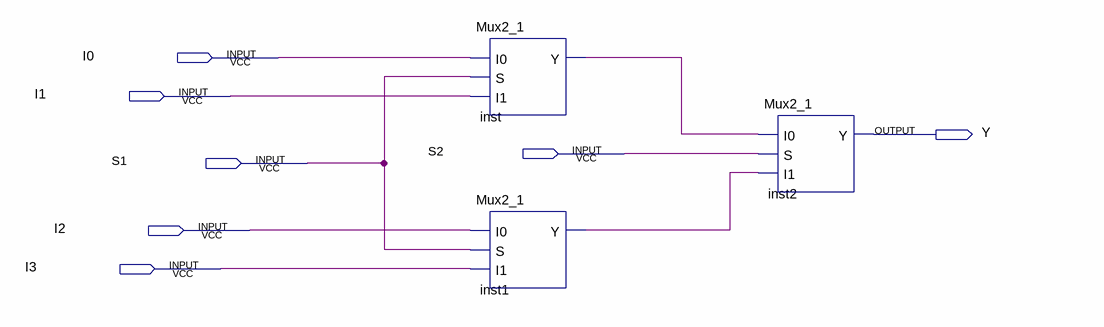
[diagram p0: schematic sheet]
// Quartus schematic Mux4_1.bdf as structural Verilog: 3 symbols, 7 pins
module Mux4_1 (
  input  I0,
  input  I1,
  input  S2,
  input  S1,
  input  I2,
  input  I3,
  output Y
);

  wire inst1_y, inst_y;

  Mux2_1 inst (.I0(I0), .S(S1), .I1(I1), .Y(inst_y));
  Mux2_1 inst1 (.I0(I2), .S(S1), .I1(I3), .Y(inst1_y));
  Mux2_1 inst2 (.I0(inst_y), .S(S2), .I1(inst1_y), .Y(Y));
endmodule
